# Altium schematic sheet [1] Block Diagram.SchDoc
size A
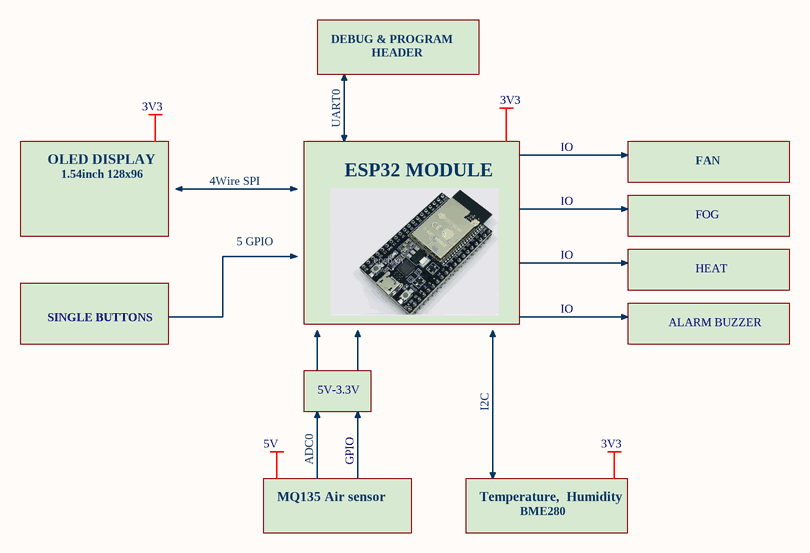
[diagram p0: [1] Block Diagram.SchDoc]

## Notes on the sheet
- DEBUG & PROGRAM
- HEADER
- 3V3
- UART0
- IO
- OLED DISPLAY
- 1.54inch 128x96
- 4Wire SPI
- ESP32 MODULE
- FAN
- FOG
- 5 GPIO
- HEAT
- SINGLE BUTTONS
- ALARM BUZZER
- 5V-3.3V
- I2C
- 5V
- ADC0
- GPIO
- MQ135 Air sensor
- Temperature,  Humidity
- BME280